# Altium schematic sheet Sensor.SchDoc
size A4; SheetNumber: 5; SheetTotal: 5
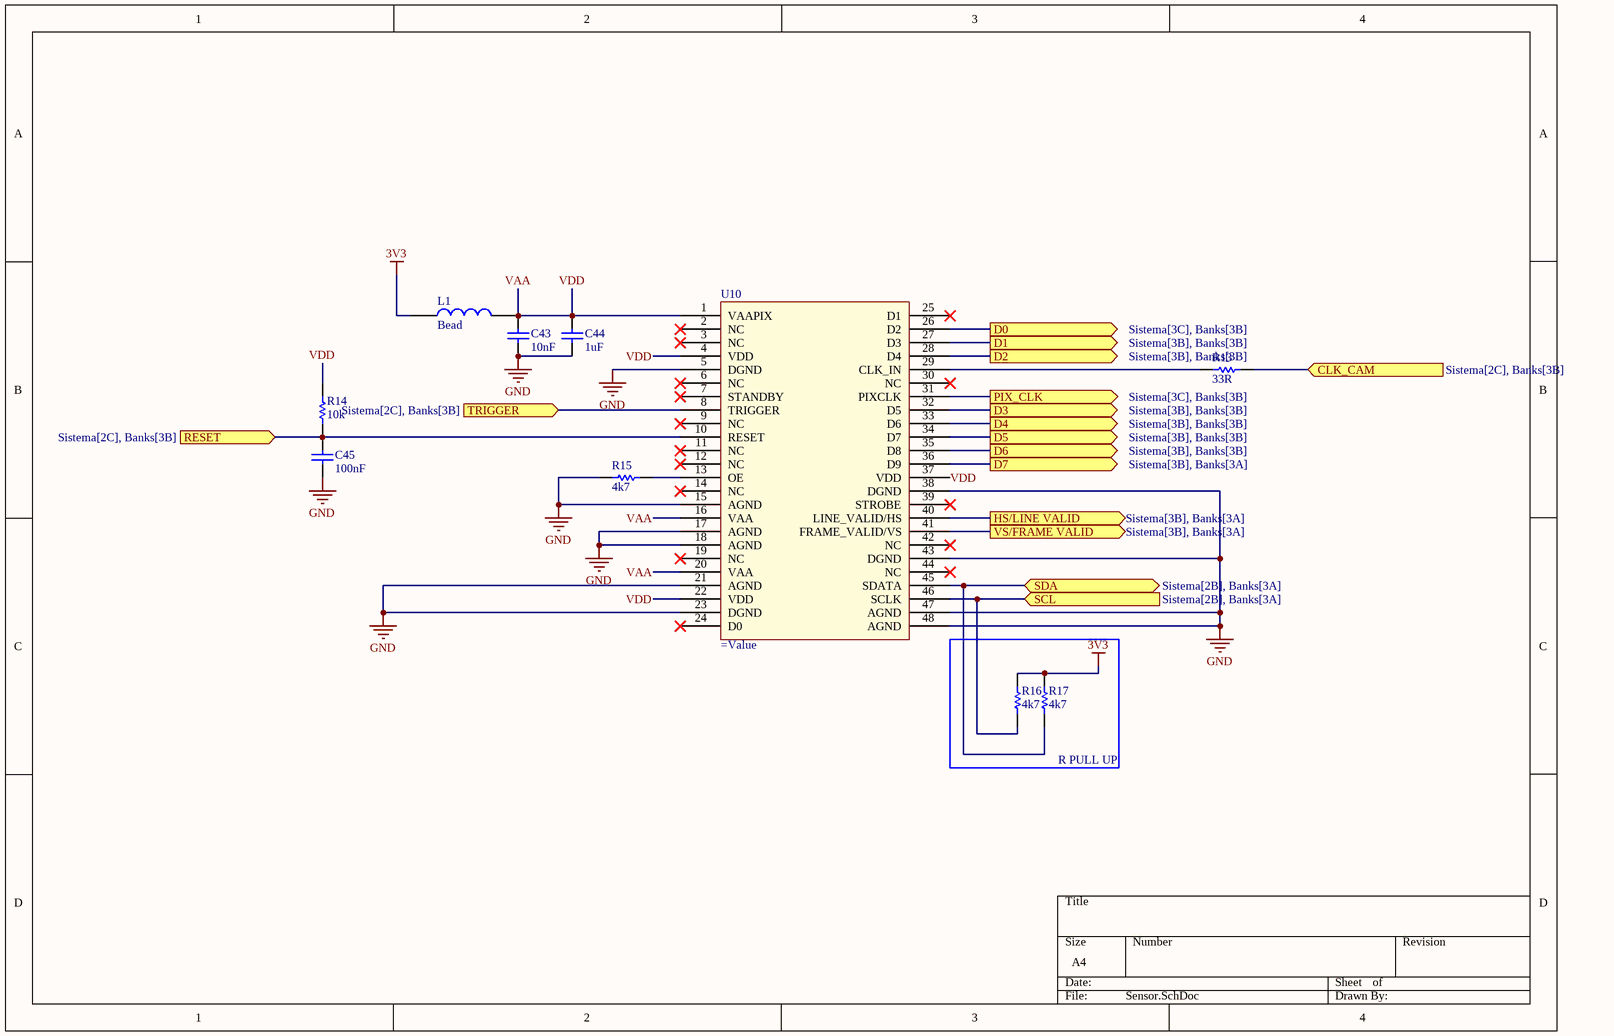
[diagram p0: Sensor.SchDoc]

## Parts
C43  10nF  [C_0805_2013_b]
C44  1uF  [C_0805_2013_b]
C45  100nF  [C_0805_2013_b]
L1  Bead  [L_0805_2013]
R13  33R  [R_0805_2012_a]
R14  10k  [R_0805_2012_a]
R15  4k7  [R_0805_2012_a]
R16  4k7  [R_0805_2012_a]
R17  4k7  [R_0805_2012_a]
U10  (no value)  [U_CLCC48_SOCKET]

## Blocks framed on the sheet
R PULL UP: R16 R17

## Ports
CLK_CAM (in, see Sistema[2C], Banks[3B]), D0 (out, see Sistema[3C], Banks[3B]), D1 (out, see Sistema[3B], Banks[3B]), D2 (out, see Sistema[3B], Banks[3B]), D3 (out, see Sistema[3B], Banks[3B]), D4 (out, see Sistema[3B], Banks[3B]), D5 (out, see Sistema[3B], Banks[3B]), D6 (out, see Sistema[3B], Banks[3B]), D7 (out, see Sistema[3B], Banks[3A]), HS/LINE VALID (out, see Sistema[3B], Banks[3A]), PIX_CLK (out, see Sistema[3C], Banks[3B]), RESET (in, see Sistema[2C], Banks[3B]), SCL (in, see Sistema[2B], Banks[3A]), SDA (bidir, see Sistema[2B], Banks[3A]), TRIGGER (in, see Sistema[2C], Banks[3B]), VS/FRAME VALID (out, see Sistema[3B], Banks[3A])

## Nets
3V3: L1.1 R16.2 R17.2
GND: C43.1 C44.1 C45.1 R15.1 U10.5(DGND) U10.15(AGND) U10.17(AGND) U10.18(AGND) U10.21(AGND) U10.23(DGND) U10.38(DGND) U10.43(DGND) U10.47(AGND) U10.48(AGND)
CLK_CAM: R13.2 ; port CLK_CAM
D0: U10.26(D2) ; port D0
D1: U10.27(D3) ; port D1
D2: U10.28(D4) ; port D2
D3: U10.32(D5) ; port D3
D4: U10.33(D6) ; port D4
D5: U10.34(D7) ; port D5
D6: U10.35(D8) ; port D6
D7: U10.36(D9) ; port D7
HS/LINE VALID: U10.40(LINE_VALID/HS) ; port HS/LINE VALID
PIX_CLK: U10.31(PIXCLK) ; port PIX_CLK
RESET: C45.2 R14.1 U10.10(RESET) ; port RESET
SCL: R16.1 U10.46(SCLK) ; port SCL
SDA: R17.1 U10.45(SDATA) ; port SDA
TRIGGER: U10.8(TRIGGER) ; port TRIGGER
VAA: C43.2 C44.2 L1.2 R14.2 U10.1(VAAPIX) U10.4(VDD) U10.16(VAA) U10.20(VAA) U10.22(VDD) U10.37(VDD)  [also labelled VDD]
VS/FRAME VALID: U10.41(FRAME_VALID/VS) ; port VS/FRAME VALID
NetR13_1: R13.1 U10.29(CLK_IN)
NetR15_2: R15.2 U10.13(OE)

Not connected (* = marked no-connect by the designer): U10 2(NC)* 3(NC)* 6(NC)* 7(STANDBY)* 9(NC)* 11(NC)* 12(NC)* 14(NC)* 19(NC)* 24(D0)* 25(D1)* 30(NC)* 39(STROBE)* 42(NC)* 44(NC)*

## Library data of the parts
C43 = C_10nF_50V_b: Capacitor SMD 0805; Manufacturer: KEMET; Manufacturer Part Number: C0805C103J5RAC7210; Dielectric Material: Ceramic; Tolerance: 5%; Voltage Rating: 50V; Dielectric: X7R; Case/Package: 0805; Case Code (Imperial): 0805; Case Code (Metric): 2012; Min Operating Temperature: -55°C; Max Operating Temperature: 125°C; Packaging: Tape and Reel; Package Quantity: 10000; Voltage Rating (DC): 50V; Termination: SMD/SMT; Series: SMD Comm X7R; Length: 2mm; Lead Pitch: 0.75mm; Depth: 1.25mm; RoHS Compliant: Yes; ComponentLink1URL: http://www.mouser.com/ds/2/212/KEM_C1002_X7R_SMD-1102033.pdf?src-supplier=Mouser; ComponentLink1Description: http://www.mouser.com/ds/2/212/KEM_C1002_X7R_SMD-1102033.pdf?src-supplier=Mouser; ComponentLink2URL: http://components.arrow.com/part/dataview/3450688S9650973N7429?src-supplier=Arrow+Electronics; ComponentLink2Description: http://components.arrow.com/part/dataview/3450688S9650973N7429?src-supplier=Arrow+Electronics; ComponentLink3URL: https://datasheet.octopart.com/C0805C103J5RAC7210-KEMET-datasheet-68331906.pdf?src-supplier=Farnell; ComponentLink3Description: https://datasheet.octopart.com/C0805C103J5RAC7210-KEMET-datasheet-68331906.pdf?src-supplier=Farnell; ComponentLink4URL: https://api.kemet.com/component-edge/download/datasheet/C0805C103J5RAC7210.pdf?src-supplier=Digikey; ComponentLink4Description: https://api.kemet.com/component-edge/download/datasheet/C0805C103J5RAC7210.pdf?src-supplier=Digikey; ComponentLink5URL: https://datasheet.octopart.com/C0805C103J5RAC7210-KEMET-datasheet-37550250.pdf?src-supplier=Electro+Sonic; ComponentLink5Description: https://datasheet.octopart.com/C0805C103J5RAC7210-KEMET-datasheet-37550250.pdf?src-supplier=Electro+Sonic; ComponentLink6URL: https://datasheet.octopart.com/C0805C103J5RAC7210-KEMET-datasheet-166547538.pdf?src-supplier=TME; ComponentLink6Description: https://datasheet.octopart.com/C0805C103J5RAC7210-KEMET-datasheet-166547538.pdf?src-supplier=TME; Supplier 1: Mouser; Supplier Part Number 1: 80-C0805C103J5R7210; RoHS: Yes; Category: Ceramic Capacitors; Stock 1: 30128; Pricing 1: 1=0,1, 10=0,034, 50=0,034, 100=0,02, 1000=0,014, 10000=0,009 (USD); Value: 10nF
C44 = C_1uF_50V_b: Capacitor SMD 0805; Manufacturer: Cal-Chip Electronics; Manufacturer Part Number: GMC21X7R105K50NT; Supplier 1: Digikey; Supplier Part Number 1: 4713-GMC21X7R105K50NTCT-ND; RoHS: Yes; Category: Ceramic Capacitors; Stock 1: 1410; Pricing 1: 1=0,16, 10=0,106, 50=0,0632, 100=0,0497, 500=0,03672, 1000=0,0304 (USD); Value: 1uF; JLCPCB Part #: C17287262
C45 = C_100nF_50V_b: Capacitor SMD 0805; Manufacturer: Yageo; Manufacturer Part Number: CC0805KRX7R9BB104; Material: Ceramic; Tolerance: 10%; Dielectric: X7R; Voltage: 50V; Insulation Resistance: 100GR; Mounting Technology: Surface Mount; Case/Package: 0805; Pins: 2; Case Code (Metric): 2012; Case Code (Imperial): 0805; Min Operating Temperature: -55°C; Max Operating Temperature: 125°C; Packaging: Tape and Reel; Voltage Rating: 50V; Package Quantity: 4000; Termination: SMD/SMT; Series: CC; Length: 2mm; Height: 0.85mm; Depth: 1.25mm; Radiation Hardening: No; RoHS Compliant: Yes; Reach SVHC Compliant: No; Halogen Free: 5694HalogenFree; Lead Free: 5697LeadFree; ComponentLink1URL: https://datasheet.ciiva.com/11786/0900766b80d84f1d-11786009.pdf?src-supplier=Rs; ComponentLink1Description: https://datasheet.ciiva.com/11786/0900766b80d84f1d-11786009.pdf?src-supplier=Rs; ComponentLink2URL: https://datasheet.ciiva.com/46393/1734573-46393307.pdf?src-supplier=Element14; ComponentLink2Description: https://datasheet.ciiva.com/46393/1734573-46393307.pdf?src-supplier=Element14; ComponentLink3URL: https://datasheet.ciiva.com/155/mlccorderingcode-155930.pdf?src-supplier=Digikey; ComponentLink3Description: https://datasheet.ciiva.com/155/mlccorderingcode-155930.pdf?src-supplier=Digikey; ComponentLink4URL: https://datasheet.ciiva.com/155/mlccorderingcode-155929.pdf?src-supplier=Digikey; ComponentLink4Description: https://datasheet.ciiva.com/155/mlccorderingcode-155929.pdf?src-supplier=Digikey; ComponentLink5URL: https://datasheet.ciiva.com/155/mlccorderingcode-155931.pdf?src-supplier=Digikey; ComponentLink5Description: https://datasheet.ciiva.com/155/mlccorderingcode-155931.pdf?src-supplier=Digikey; ComponentLink6URL: https://datasheet.ciiva.com/11464/upy-gphc-x7r-6-3v-to-50v-8-11464757.pdf?src-supplier=Avnet; ComponentLink6Description: https://datasheet.ciiva.com/11464/upy-gphc-x7r-6-3v-to-50v-8-11464757.pdf?src-supplier=Avnet; ComponentLink7URL: https://datasheet.ciiva.com/28450/1489800-28450805.pdf?src-supplier=Element14; ComponentLink7Description: https://datasheet.ciiva.com/28450/1489800-28450805.pdf?src-supplier=Element14; ComponentLink8URL: https://datasheet.ciiva.com/29242/445210-da-01-en-kerko-chip-0805-x7r-0-1uf-10proz-50vg-29242074.pdf?src-supplier=Conrad; ComponentLink8Description: https://datasheet.ciiva.com/29242/445210-da-01-en-kerko-chip-0805-x7r-0-1uf-10proz-50vg-29242074.pdf?src-supplier=Conrad; Supplier 1: Digikey; Supplier Part Number 1: 311-1140-1-ND; RoHS: Yes; Category: Ceramic Capacitors; Stock 1: 5306374; Pricing 1: 1=0,1, 10=0,07, 50=0,0418, 100=0,0329, 500=0,02428, 1000=0,0201 (USD); Value: 100nF
L1 = L_Bead: Inductor SMD 0805; Manufacturer: Pulse; Manufacturer Part Number: PE-0805PFB600ST; Number of Lines: 1; Max Current Rating: 3A; Mounting Technology: Surface Mount; Case/Package: 0805; Case Code (Metric): 2012; Case Code (Imperial): 0805; Min Operating Temperature: -40°C; Max Operating Temperature: 105°C; Package Quantity: 4000; Packaging: Cut Tape; Series: PFB; Length: 0.079inch; Width: 0.049inch; Height: 0.041inch; RoHS Compliant: Yes; ComponentLink1URL: https://productfinder.pulseeng.com/doc_type/WEB301/doc_num/WC706/doc_part/WC706.pdf?src-supplier=Digikey; ComponentLink1Description: https://productfinder.pulseeng.com/doc_type/WEB301/doc_num/WC706/doc_part/WC706.pdf?src-supplier=Digikey; ComponentLink2URL: http://productfinder.pulseeng.com/products/datasheets/WC706.pdf?src-supplier=Digikey; ComponentLink2Description: http://productfinder.pulseeng.com/products/datasheets/WC706.pdf?src-supplier=Digikey; Supplier 1: Mouser; Supplier Part Number 1: 673-PE-0805PFB600ST; RoHS: Yes; Category: Ferrite Beads and Chips; Stock 1: 58506; Pricing 1: 1=0,1, 10=0,051, 50=0,051, 100=0,035, 1000=0,025, 10000=0,02 (USD); Value: Bead
R13 = R_33R_b: Resistor SMD 0805; Manufacturer: Stackpole Electronics; Manufacturer Part Number: RMCF0805FT33R0; Tolerance: 1%; Max Power Dissipation: 125mW; Temperature Coefficient: 100ppm/°C; Voltage Rating: 150V; Mounting Technology: Surface Mount; Case/Package: 0805; Case Code (Metric): 2012; Case Code (Imperial): 0805; Contact Plating: Tin,Matte; Min Operating Temperature: -55°C; Max Operating Temperature: 155°C; Packaging: Tape and Reel; Number of Terminations: 2; Features: Automotive AEC-Q200; Series: RMCF; Length: 0.079inch; Width: 0.049inch; Height: 0.026inch; Ratings: AEC-Q200; Radiation Hardening: No; RoHS Compliant: Yes; ComponentLink1URL: http://components.arrow.com/part/dataview/50498375S389572N1174?src-supplier=Arrow+Electronics; ComponentLink1Description: http://components.arrow.com/part/dataview/50498375S389572N1174?src-supplier=Arrow+Electronics; ComponentLink2URL: https://www.seielect.com/catalog/SEI-RMCF_RMCP.pdf?src-supplier=Avnet; ComponentLink2Description: https://www.seielect.com/catalog/SEI-RMCF_RMCP.pdf?src-supplier=Avnet; ComponentLink3URL: https://www.seielect.com/Catalog/SEI-RMCF_RMCP.pdf?src-supplier=Digikey; ComponentLink3Description: https://www.seielect.com/Catalog/SEI-RMCF_RMCP.pdf?src-supplier=Digikey; ComponentLink4URL: https://www.seielect.com/catalog/SEI-Packaging.pdf?src-supplier=Digikey; ComponentLink4Description: https://www.seielect.com/catalog/SEI-Packaging.pdf?src-supplier=Digikey; Supplier 1: Digikey; Supplier Part Number 1: RMCF0805FT33R0CT-ND; RoHS: Yes; Category: Chip SMD Resistors; Stock 1: 76142; Pricing 1: 1=0,1, 10=0,02, 50=0,0124, 100=0,0103, 500=0,007, 1000=0,00601 (USD); Value: 33R
R14 = R_10k_b: Resistor SMD 0805; Manufacturer: Yageo; Manufacturer Part Number: AC0805FR-0710KL; Tolerance: 1%; Power Rating: 125mW; Voltage Rating: 150V; Temperature Coefficient: 100ppm/°C; Case/Package: 0805; Case Code (Metric): 2012; Case Code (Imperial): 0805; Min Operating Temperature: -55°C; Max Operating Temperature: 155°C; Packaging: Tape and Reel; Package Quantity: 1; Number of Terminations: 2; Termination: SMD/SMT; Max Power Dissipation: 125mW; Features: Moisture Resistant,Automotive AEC-Q200,Anti-Sulfur; Series: AC; Construction: Rectangular; Length: 0.079inch; Width: 0.049inch; Height: 0.024inch; Depth: 1.25mm; Military Standard: Not; Lead Free: Lead Free; RoHS Compliant: Yes; ComponentLink1URL: http://www.yageo.com/NewPortal/yageodocoutput?fileName=/pdf/R-Chip/PYu-AC_51_RoHS_L_6.pdf&src-supplier=Digikey; ComponentLink1Description: http://www.yageo.com/NewPortal/yageodocoutput?fileName=/pdf/R-Chip/PYu-AC_51_RoHS_L_6.pdf&src-supplier=Digikey; ComponentLink2URL: http://www.yageo.com/documents/recent/PYu-AC_51_RoHS_L_2_revised.pdf?src-supplier=Future+Electronics; ComponentLink2Description: http://www.yageo.com/documents/recent/PYu-AC_51_RoHS_L_2_revised.pdf?src-supplier=Future+Electronics; ComponentLink3URL: http://www.yageo.com/NewPortal/yageodocoutput?fileName=/pdf/R-Chip/PYu-AC_51_RoHS_L_6.pdf&src-supplier=NAC+Semi; ComponentLink3Description: http://www.yageo.com/NewPortal/yageodocoutput?fileName=/pdf/R-Chip/PYu-AC_51_RoHS_L_6.pdf&src-supplier=NAC+Semi; ComponentLink4URL: http://www.yageo.com/NewPortal/yageodocoutput?fileName=/pdf/R-Chip/PYu-AC_51_RoHS_L_6.pdf&src-supplier=Rutronik; ComponentLink4Description: http://www.yageo.com/NewPortal/yageodocoutput?fileName=/pdf/R-Chip/PYu-AC_51_RoHS_L_6.pdf&src-supplier=Rutronik; Supplier 1: Digikey; Supplier Part Number 1: 311-10KLGCT-ND; RoHS: Yes; Category: Chip SMD Resistors; Stock 1: 480247; Pricing 1: 1=0,1, 10=0,031, 50=0,0198, 100=0,0166, 500=0,01152, 1000=0,00997 (USD); Value: 10k
R15-R17 = R_4k7_b: Resistor SMD 0805; Manufacturer: Stackpole Electronics; Manufacturer Part Number: RMCF0805FT4K70; Tolerance: 1%; Power Rating: 125mW; Temperature Coefficient: 100ppm/°C; Mounting Technology: Surface Mount; Case/Package: 0805; Case Code (Metric): 2012; Case Code (Imperial): 0805; Contact Plating: Tin,Matte; Min Operating Temperature: -55°C; Max Operating Temperature: 155°C; Packaging: Tape and Reel; Number of Terminations: 2; Max Power Dissipation: 125mW; Features: Automotive AEC-Q200; Series: RMCF; Construction: Rectangular; Length: 2mm; Width: 0.049inch; Height: 0.026inch; Depth: 1.25mm; Ratings: AEC-Q200; Radiation Hardening: No; Military Standard: Not; Lead Free: Lead Free; RoHS Compliant: Yes; ComponentLink1URL: https://www.seielect.com/catalog/SEI-RMCF_RMCP.pdf?src-supplier=Avnet; ComponentLink1Description: https://www.seielect.com/catalog/SEI-RMCF_RMCP.pdf?src-supplier=Avnet; ComponentLink2URL: https://www.seielect.com/Catalog/SEI-RMCF_RMCP.pdf?src-supplier=Digikey; ComponentLink2Description: https://www.seielect.com/Catalog/SEI-RMCF_RMCP.pdf?src-supplier=Digikey; ComponentLink3URL: https://www.seielect.com/catalog/SEI-Packaging.pdf?src-supplier=Digikey; ComponentLink3Description: https://www.seielect.com/catalog/SEI-Packaging.pdf?src-supplier=Digikey; ComponentLink4URL: http://components.arrow.com/part/dataview/44988207S7163511N1174?src-supplier=Arrow+Electronics; ComponentLink4Description: http://components.arrow.com/part/dataview/44988207S7163511N1174?src-supplier=Arrow+Electronics; ComponentLink5URL: http://www.seielect.com/catalog/sei-rmc.pdf?src-supplier=Future+Electronics; ComponentLink5Description: http://www.seielect.com/catalog/sei-rmc.pdf?src-supplier=Future+Electronics; ComponentLink6URL: https://datasheet.octopart.com/RMCF0805FT4K70-Stackpole-Electronics-datasheet-11547379.pdf?src-supplier=Future+Electronics; ComponentLink6Description: https://datasheet.octopart.com/RMCF0805FT4K70-Stackpole-Electronics-datasheet-11547379.pdf?src-supplier=Future+Electronics; ComponentLink7URL: https://www.verical.com/server-webapp/html/getDatasheet?partID=409513&src-supplier=Verical; ComponentLink7Description: https://www.verical.com/server-webapp/html/getDatasheet?partID=409513&src-supplier=Verical; Supplier 1: Digikey; Supplier Part Number 1: RMCF0805FT4K70CT-ND; RoHS: Yes; Category: Chip SMD Resistors; Stock 1: 619298; Pricing 1: 1=0,1, 10=0,02, 50=0,0124, 100=0,0103, 500=0,007, 1000=0,00601 (USD); Value: 4k7
U10 = MT9M001C12STM: SENSOR 1/2 PULGADA 1 MEGAPIXEL; Supplier 1: Newark; Supplier Part Number 1: 30AC9943; Supplier 2: Farnell; Supplier Part Number 2: 3613986; ComponentLink1Description: DATASHEET; ComponentLink1URL: https://github.com/Fresita-codificadora/Proyecto_Final_DOME/blob/main/datasheet/HOJA_DE_DATOS_IMAGER_mt9m001_USADO_CON_FPGA.pdf